# Altium project PCB_Project.PrjPcb
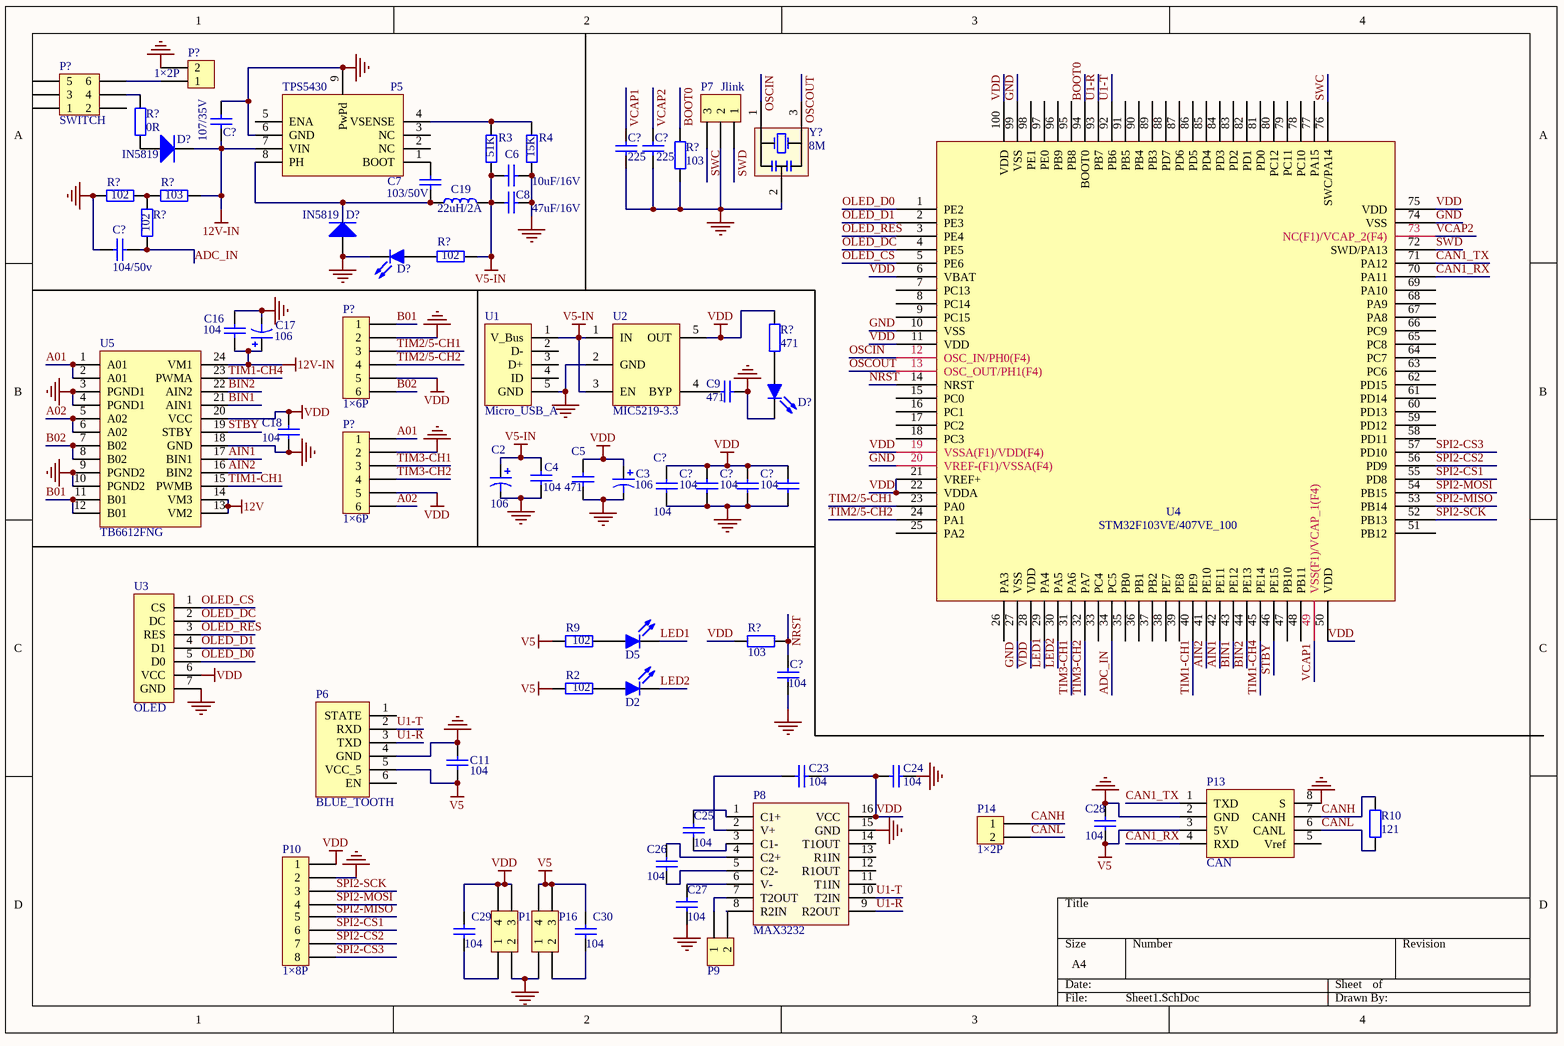
[diagram p0: Sheet1.SchDoc]
1 sheet, 69 parts. Net scope: global (net labels, ports and power ports of the same name join across sheets).
Board file: PCB1.PcbDoc

## Sheet Sheet1.SchDoc
size A4

### Parts
(Parts that share a designator on the sheet are numbered #1, #2 ... from top to bottom, then left to right.)
C2  value 106  [AVX A-CASE 1206]  (hidden comment: Cap-AVX)
C3  value 106  [AVX A-CASE 1206]  (hidden comment: Cap-AVX)
C4  value 104  [Cap 0603]  (hidden comment: Cap Semi)
C5  value 471  [Cap 0603]  (hidden comment: Cap Semi)
C6  value 10uF/16V  [CAP 1206]  (hidden comment: Cap Semi)
C7  value 103/50V  [Cap 0603]  (hidden comment: Cap Semi)
C8  value 47uF/16V  [Cap 1210]  (hidden comment: Cap Semi)
C9  value 471  [Cap 0603]  (hidden comment: Cap Semi)
C11  value 104  [Cap 0603]  (hidden comment: Cap Semi)
C16  value 104  [Cap 0603]  (hidden comment: Cap Semi)
C17  value 106  [AVX B-CASE 3528]  (hidden comment: Cap-AVX)
C18  value 104  [Cap 0603]  (hidden comment: Cap Semi)
C19  value 22uH/2A  [CD54 7*7]  (hidden comment: CD54)
C23  value 104  [Cap 0603]  (hidden comment: Cap Semi)
C24  value 104  [Cap 0603]  (hidden comment: Cap Semi)
C25  value 104  [Cap 0603]  (hidden comment: Cap Semi)
C26  value 104  [Cap 0603]  (hidden comment: Cap Semi)
C27  value 104  [Cap 0603]  (hidden comment: Cap Semi)
C28  value 104  [Cap 0603]  (hidden comment: Cap Semi)
C29  value 104  [Cap 0603]  (hidden comment: Cap Semi)
C30  value 104  [Cap 0603]  (hidden comment: Cap Semi)
C?#1  value 107/35V  [Cap 1812]  (hidden comment: Cap Semi)
C?#2  value 225  [Cap 0603]  (hidden comment: Cap Semi)
C?#3  value 225  [Cap 0603]  (hidden comment: Cap Semi)
C?#4  value 104/50v  [Cap 0603]  (hidden comment: Cap Semi)
C?#5  value 104  [Cap 0603]  (hidden comment: Cap Semi)
C?#6  value 104  [Cap 0603]  (hidden comment: Cap Semi)
C?#7  value 104  [Cap 0603]  (hidden comment: Cap Semi)
C?#8  value 104  [Cap 0603]  (hidden comment: Cap Semi)
C?#9  value 104  [Cap 0603]  (hidden comment: Cap Semi)
D2  LED  [led 0603 B]  (value not drawn)
D5  LED  [led 0603 B]  (value not drawn)
D?#1  IN5819  [SOD-323]
D?#2  IN5819  [SOD-323]
D?#3  LED  [led 0603 B]  (value not drawn)
D?#4  LED  [led 0603 B]  (value not drawn)
P5  TPS5430  [TPS5430]
P6  BLUE_TOOTH  [1×6P]
P7  Jlink  [1×3P]
P8  MAX3232  [SOP-16]
P9  1×2P  [1×2P]  (value not drawn)
P10  1×8P  [1×8P_SG]
P13  CAN  [SOP8]
P14  1×2P  [1×2P]
P15  2×2P  [2×2P]  (value not drawn)
P16  2×2P  [2×2P]  (value not drawn)
P?#1  1×2P  [1×2P]
P?#2  SWITCH  [SWITCH(S)]
P?#3  1×6P  [1×6P]
P?#4  1×6P  [1×6P]
R2  value 102  [Res 0603]  (hidden comment: Res)
R3  value 51K  [Res 0603]  (hidden comment: Res)
R4  value 15K  [Res 0603]  (hidden comment: Res)
R9  value 102  [Res 0603]  (hidden comment: Res)
R10  value 121  [Res 0603]  (hidden comment: Res)
R?#1  value 0R  [Res 0603]  (hidden comment: Res)
R?#2  value 103  [Res 0603]  (hidden comment: Res)
R?#3  value 102  [Res 0603]  (hidden comment: Res)
R?#4  value 103  [Res 0603]  (hidden comment: Res)
R?#5  value 102  [Res 0603]  (hidden comment: Res)
R?#6  value 102  [Res 0603]  (hidden comment: Res)
R?#7  value 471  [Res 0603]  (hidden comment: Res)
R?#8  value 103  [Res 0603]  (hidden comment: Res)
U1  Micro_USB_A  [Micro_USB_A]
U2  MIC5219-3.3  [MIC5219-3.3]
U3  OLED  [OLED(0.96) IIC]
U4  STM32F103VE/407VE_100  [LQFP100]
U5  TB6612FNG  [SSOP-24N]
Y?  value 8M  [XTAL 3.2x1.3]  (hidden comment: XTAL-3)

### Nets
12V: U5.13(VM2) U5.14(VM3)
12V-IN: C16.1 C17.1 C?#1.1 D?#1.2(K) P5.7(VIN) R?#4.2 U5.24(VM1)
GND: C2.2 C3.2 C4.1 C5.1 C6.1 C8.2 C9.1 C11.1 C16.2 C17.2 C18.2 C24.1 C27.2 C28.2 C?#1.2 C?#2.2 C?#3.2 C?#4.1 C?#5.1 C?#6.1 C?#7.1 C?#8.1 C?#9.1 D?#2.1(A) D?#3.2 D?#4.2 P5.6(GND) P5.9(PwPd) P6.4(GND) P7.2 P8.15(GND) P10.2 P13.2(GND) P13.8(S) P15.2 P16.1 P?#1.2 P?#3.2 P?#4.2 R4.1 R?#2.2 R?#3.1 U1.5(GND) U2.2(GND) U3.7(GND) U4.10(VSS) U4.20(VREF-(F1)/VSSA(F4)) U4.27(VSS) U4.74(VSS) U4.99(VSS) U5.3(PGND1) U5.4(PGND1) U5.9(PGND2) U5.10(PGND2) U5.18(GND) Y?.2
V5: C11.2 C28.1 C30.2 P6.5(VCC_5) P13.3(5V) P16.3 P16.4 R2.1 R9.1
V5-IN: C2.1 C4.2 C6.2 C8.1 C19.2 R3.1 R?#6.1 U1.1(V_Bus) U2.1(IN) U2.3(EN)
VDD: C3.1 C5.2 C18.1 C23.1 C24.2 C29.2 C?#5.2 C?#6.2 C?#7.2 C?#8.2 P8.16(VCC) P10.1 P15.3 P15.4 P?#3.5 P?#4.5 R?#7.2 R?#8.1 U2.5(OUT) U3.6(VCC) U4.6(VBAT) U4.11(VDD) U4.19(VSSA(F1)/VDD(F4)) U4.21(VREF+) U4.22(VDDA) U4.28(VDD) U4.50(VDD) U4.75(VDD) U4.100(VDD) U5.20(VCC)
A01: P?#4.1 U5.1(A01) U5.2(A01)
A02: P?#4.6 U5.5(A02) U5.6(A02)
ADC_IN: C?#4.2 R?#5.1 U4.34(PC5)
AIN1: U4.42(PE11) U5.17(BIN1)
AIN2: U4.41(PE10) U5.16(BIN2)
B01: P?#3.1 U5.11(B01) U5.12(B01)
B02: P?#3.6 U5.7(B02) U5.8(B02)
BIN1: U4.43(PE12) U5.21(AIN1)
BIN2: U4.44(PE13) U5.22(AIN2)
BOOT0: U4.94(BOOT0)
CAN1_RX: P13.4(RXD) U4.70(PA11)
CAN1_TX: P13.1(TXD) U4.71(PA12)
CANH: P13.7(CANH) P14.1 R10.2
CANL: P13.6(CANL) P14.2 R10.1
LED1: D5.2 U4.29(PA4)
LED2: D2.2 U4.30(PA5)
NRST: C?#9.2 R?#8.2 U4.14(NRST)
OLED_CS: U3.1(CS) U4.5(PE6)
OLED_D0: U3.5(D0) U4.1(PE2)
OLED_D1: U3.4(D1) U4.2(PE3)
OLED_DC: U3.2(DC) U4.4(PE5)
OLED_RES: U3.3(RES) U4.3(PE4)
OSCIN: U4.12(OSC_IN/PH0(F4)) Y?.1
OSCOUT: U4.13(OSC_OUT/PH1(F4)) Y?.3
SPI2-CS1: P10.6 U4.55(PD8)
SPI2-CS2: P10.7 U4.56(PD9)
SPI2-CS3: P10.8 U4.57(PD10)
SPI2-MISO: P10.5 U4.53(PB14)
SPI2-MOSI: P10.4 U4.54(PB15)
SPI2-SCK: P10.3 U4.52(PB13)
STBY: U4.46(PE15) U5.19(STBY)
SWC: P7.3 U4.76(SWC/PA14)
SWD: P7.1 U4.72(SWD/PA13)
TIM1-CH1: U4.40(PE9) U5.15(PWMB)
TIM1-CH4: U4.45(PE14) U5.23(PWMA)
TIM2/5-CH1: P?#3.3 U4.23(PA0)
TIM2/5-CH2: P?#3.4 U4.24(PA1)
TIM3-CH1: P?#4.3 U4.31(PA6)
TIM3-CH2: P?#4.4 U4.32(PA7)
U1-R: P6.3(TXD) P8.9(R2OUT) U4.93(PB7)
U1-T: P6.2(RXD) P8.10(T2IN) U4.92(PB6)
VCAP1: C?#2.1 U4.49(VSS(F1)/VCAP_1(F4))
VCAP2: C?#3.1 U4.73(NC(F1)/VCAP_2(F4))
NetC7_1: C7.1 C19.1 D?#2.2(K) P5.8(PH)
NetC7_2: C7.2 P5.1(BOOT)
NetC9_2: C9.2 U2.4(BYP)
NetC23_2: C23.2 P8.2(V+)
NetC25_1: C25.1 P8.3(C1-)
NetC25_2: C25.2 P8.1(C1+)
NetC26_1: C26.1 P8.4(C2+)
NetC26_2: C26.2 P8.5(C2-)
NetC27_1: C27.1 P8.6(V-)
NetC29_1: C29.1 P15.1
NetC30_1: C30.1 P16.2
NetD2_1: D2.1 R2.2
NetD5_1: D5.1 R9.2
NetD?#1_1: D?#1.1(A) R?#1.1
NetD?#3_1: D?#3.1 R?#6.2
NetD?#4_1: D?#4.1 R?#7.1
NetP5_4: P5.4(VSENSE) R3.2 R4.2
NetP8_7: P8.7(T2OUT) P9.1
NetP8_8: P8.8(R2IN) P9.2
NetP?#1_1: P?#1.1 P?#2.6
NetP?#2_4: P?#2.4 R?#1.2
NetR?#3_2: R?#3.2 R?#4.1 R?#5.2

Not connected (* = marked no-connect by the designer): P5 2(NC) 3(NC) 5(ENA); P6 1(STATE) 6(EN); P8 11(T1IN) 12(R1OUT) 13(R1IN) 14(T1OUT); P13 5(Vref); P?#2 1 2 3 5; R?#2 1; U1 2(D-) 3(D+) 4(ID); U4 7(PC13) 8(PC14) 9(PC15) 15(PC0) 16(PC1) 17(PC2) 18(PC3) 25(PA2) 26(PA3) 33(PC4) 35(PB0) 36(PB1) 37(PB2) 38(PE7) 39(PE8) 47(PB10) 48(PB11) 51(PB12) 58(PD11) 59(PD12) 60(PD13) 61(PD14) 62(PD15) 63(PC6) 64(PC7) 65(PC8) 66(PC9) 67(PA8) 68(PA9) 69(PA10) 77(PA15) 78(PC10) 79(PC11) 80(PC12) 81(PD0) 82(PD1) 83(PD2) 84(PD3) 85(PD4) 86(PD5) 87(PD6) 88(PD7) 89(PB3) 90(PB4) 91(PB5) 95(PB8) 96(PB9) 97(PE0) 98(PE1)

### Notes on the sheet
- Labels drawn without touching a wire or pin: BOOT0

### Library data of the parts
C4-C9 C11 C16 C18 C23-C30 C?#1-C?#9 = Cap
P7 = 1×3P
D?#1 D?#2 = IN5819: Value: IN5819